# Altium schematic sheet OpenPLCv0.2.0_SerialInterface.SchDoc
size 420 x 297 mm; PageSetup: Record=PageOptions|CenterHorizontal=True|CenterVertical=True|PrintScale=1.01|XCorrection=1.00|YCorrection=1.00|PrintKind=1|BorderSize=5000000|LeftOffset=0|BottomOffset=0|Orientation=2|PaperLength=1000|PaperWidth=1000|Scale=100|PaperSource=7|PrintQuality=-4|MediaType=1|DitherType=10|PaperKind=A3|PrintScaleMode=1; DocumentNumber: 14; SheetNumber: 14; SheetTotal: 22; SheetTitle: USB Serial Interface
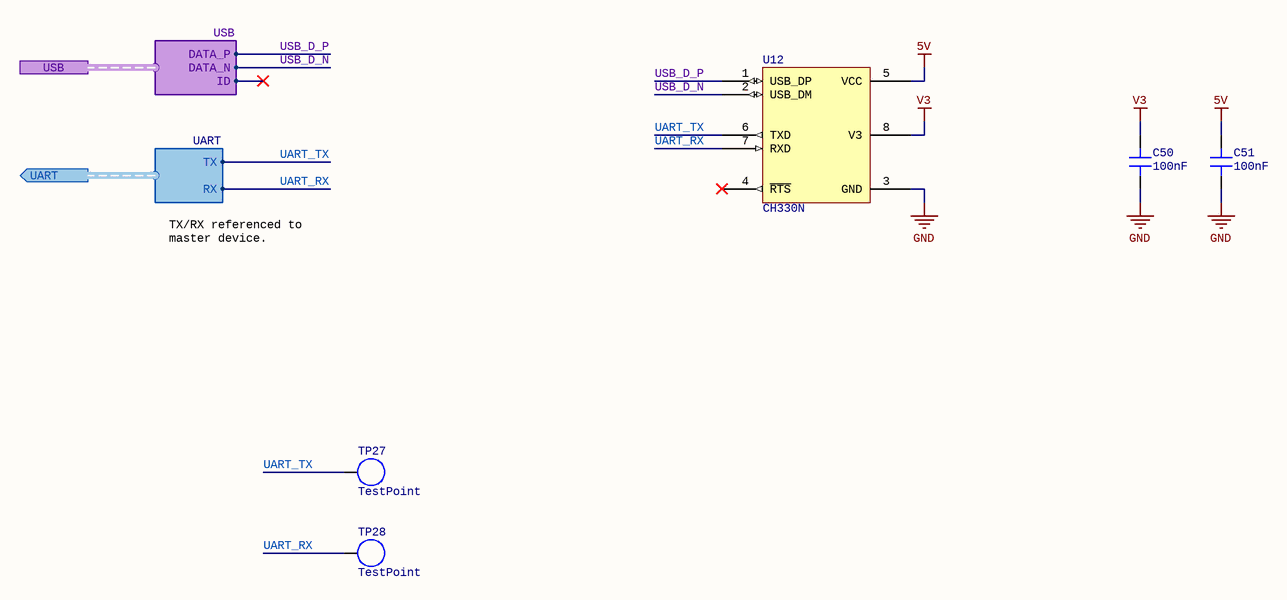
[diagram p0: OpenPLCv0.2.0_SerialInterface.SchDoc]

## Parts
C50  Capacitance: 100nF  [SMD_CAP_0402(1005)_N]  (hidden comment: CC0402KRX5R6BB104)
C51  Capacitance: 100nF  [SMD_CAP_0402(1005)_N]  (hidden comment: CC0402KRX5R6BB104)
TP27  TestPoint  [Pad]  (no BOM)
TP28  TestPoint  [Pad]  (no BOM)
U12  CH330N  [SOIC-8-3.9mm]

## Ports
UART (out, harness UART), USB (harness USB)

## Harnesses
USB: DATA_P, DATA_N, ID
UART: TX, RX

## Nets
5V: C51.2 U12.5(VCC)
GND: C50.1 C51.1 U12.3(GND)
V3: C50.2 U12.8(V3)
UART_RX: TP28.1 U12.7(RXD) ; port UART.RX
UART_TX: TP27.1 U12.6(TXD) ; port UART.TX
USB_D_N: U12.2(USB_DM) ; port USB.DATA_N
USB_D_P: U12.1(USB_DP) ; port USB.DATA_P

Not connected (* = marked no-connect by the designer): U12 4(~{RTS})*

## Notes on the sheet
- TX/RX referenced to master device.
- FILE NAME
- PROJECT
- TITLE
- REV
- AUTHOR
- SIZE
- SHEET
- DATE
- OF
- A3

## Library data of the parts
C50 C51 = 100nF 0402 10V 10%: 100nF ±10% 10V X5R 0402 Multilayer Ceramic Capacitors MLCC - SMD/SMT RoHS; Package: 0402; Tolerance: 10%; Voltage Rating: 10V
TP27 TP28 = Test point
U12 = CH330N: Transceiver USB 2.0 2Mbps SOP-8_150mil USB ICs RoHS